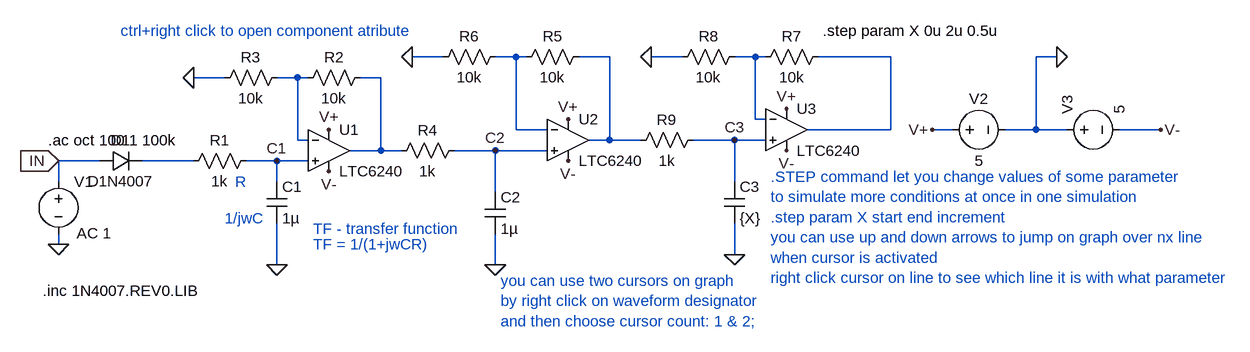
[diagram p0: schematic AC_analysis_with_three_pole_filter.asc]
AC_analysis_with_three_pole_filter.asc, the LTspice schematic file:
Version 4
SHEET 1 1444 680
WIRE -544 -16 -592 -16
WIRE -432 -16 -464 -16
WIRE -416 -16 -432 -16
WIRE -288 -16 -336 -16
WIRE -176 -16 -224 -16
WIRE -64 -16 -96 -16
WIRE -48 -16 -64 -16
WIRE 144 -16 32 -16
WIRE 400 -16 368 -16
WIRE -880 16 -928 16
WIRE -768 16 -800 16
WIRE -752 16 -768 16
WIRE -640 16 -672 16
WIRE -64 80 -64 -16
WIRE -48 80 -64 80
WIRE -432 96 -432 -16
WIRE -384 96 -432 96
WIRE 144 96 144 -16
WIRE 144 96 16 96
WIRE 240 96 208 96
WIRE 368 96 368 -16
WIRE 368 96 320 96
WIRE 416 96 368 96
WIRE 560 96 496 96
WIRE -768 112 -768 16
WIRE -752 112 -768 112
WIRE -288 112 -288 -16
WIRE -288 112 -320 112
WIRE -240 112 -288 112
WIRE -96 112 -160 112
WIRE -48 112 -96 112
WIRE -640 128 -640 16
WIRE -640 128 -688 128
WIRE -608 128 -640 128
WIRE -464 128 -528 128
WIRE -384 128 -464 128
WIRE -1072 144 -1136 144
WIRE -928 144 -1008 144
WIRE -800 144 -848 144
WIRE -752 144 -800 144
WIRE -1136 176 -1136 144
WIRE -800 176 -800 144
WIRE -96 176 -96 112
WIRE -464 192 -464 128
WIRE -1136 272 -1136 256
WIRE -96 288 -96 240
WIRE -800 304 -800 240
WIRE -464 304 -464 256
FLAG -1136 272 0
FLAG -800 304 0
FLAG -1136 144 IN
IOPIN -1136 144 In
FLAG 400 -16 0
FLAG 208 96 V+
FLAG 560 96 V-
FLAG -928 16 0
FLAG -464 304 0
FLAG -352 144 V-
FLAG -720 160 V-
FLAG -720 96 V+
FLAG -352 80 V+
FLAG -16 64 V+
FLAG -16 128 V-
FLAG -592 -16 0
FLAG -224 -16 0
FLAG -96 288 0
FLAG -800 144 C1
FLAG -464 128 C2
FLAG -96 112 C3
SYMBOL voltage -1136 160 R0
WINDOW 123 28 95 Left 2
WINDOW 39 0 0 Left 0
SYMATTR Value2 AC 1
SYMATTR InstName V1
SYMATTR Value ""
SYMBOL res -832 128 R90
WINDOW 0 0 56 VBottom 2
WINDOW 3 32 56 VTop 2
SYMATTR InstName R1
SYMATTR Value 1k
SYMBOL cap -816 176 R0
SYMATTR InstName C1
SYMATTR Value 1µ
SYMBOL OpAmps\\LTC6240 -720 128 R0
SYMATTR InstName U1
SYMBOL voltage 224 96 R270
WINDOW 0 32 56 VTop 2
WINDOW 3 -32 56 VBottom 2
SYMATTR InstName V2
SYMATTR Value 5
SYMBOL voltage 400 96 R270
WINDOW 123 0 0 Left 0
WINDOW 39 0 0 Left 0
SYMATTR InstName V3
SYMATTR Value 5
SYMBOL OpAmps\\LTC6240 -352 112 R0
SYMATTR InstName U2
SYMBOL OpAmps\\LTC6240 -16 96 R0
SYMATTR InstName U3
SYMBOL res -656 0 R90
WINDOW 0 0 56 VBottom 2
WINDOW 3 32 56 VTop 2
SYMATTR InstName R2
SYMATTR Value 10k
SYMBOL res -784 0 R90
WINDOW 0 0 56 VBottom 2
WINDOW 3 32 56 VTop 2
SYMATTR InstName R3
SYMATTR Value 10k
SYMBOL res -512 112 R90
WINDOW 0 0 56 VBottom 2
WINDOW 3 32 56 VTop 2
SYMATTR InstName R4
SYMATTR Value 1k
SYMBOL cap -480 192 R0
SYMATTR InstName C2
SYMATTR Value 1µ
SYMBOL res -320 -32 R90
WINDOW 0 0 56 VBottom 2
WINDOW 3 32 56 VTop 2
SYMATTR InstName R5
SYMATTR Value 10k
SYMBOL res -448 -32 R90
WINDOW 0 0 56 VBottom 2
WINDOW 3 32 56 VTop 2
SYMATTR InstName R6
SYMATTR Value 10k
SYMBOL res 48 -32 R90
WINDOW 0 0 56 VBottom 2
WINDOW 3 32 56 VTop 2
SYMATTR InstName R7
SYMATTR Value 10k
SYMBOL res -80 -32 R90
WINDOW 0 0 56 VBottom 2
WINDOW 3 32 56 VTop 2
SYMATTR InstName R8
SYMATTR Value 10k
SYMBOL cap -112 176 R0
SYMATTR InstName C3
SYMATTR Value {X}
SYMBOL res -144 96 R90
WINDOW 0 0 56 VBottom 2
WINDOW 3 32 56 VTop 2
SYMATTR InstName R9
SYMATTR Value 1k
SYMBOL diode -1072 160 R270
WINDOW 0 32 32 VTop 2
WINDOW 3 0 32 VBottom 2
SYMATTR InstName D1
SYMATTR Value D1N4007
TEXT -1152 112 Left 2 !.ac oct 100 1 100k
TEXT -864 176 Left 2 ;R
TEXT -880 232 Left 2 ;1/jwC
TEXT -744 248 Left 2 ;TF - transfer function
TEXT -744 272 Left 2 ;TF = 1/(1+jwCR)
TEXT -40 168 Left 2 ;.STEP command let you change values of some parameter\nto simulate more conditions at once in one simulation\n.step param X start end increment\nyou can use up and down arrows to jump on graph over nx line\nwhen cursor is activated\nright click cursor on line to see which line it is with what parameter
TEXT 40 -56 Left 2 !.step param X 0u 2u 0.5u
TEXT -1040 -56 Left 2 ;ctrl+right click to open component atribute
TEXT -1160 344 Left 2 !.inc 1N4007.REV0.LIB
TEXT -456 328 Left 2 ;you can use two cursors on graph\nby right click on waveform designator\nand then choose cursor count: 1 & 2;

The netlist it stands for:
* AC_analysis_with_three_pole_filter.asc
V1 IN 0 AC 1
R1 C1 N007 1k
C1 C1 0 1µ
* U1: LTC6240 (symbol OpAmps\LTC6240 not available, pins judged from their places): In+=C1 In-=N005 V+=V+ V-=V- OUT=N006
V2 V+ 0 5
V3 0 V- 5
* U2: LTC6240 (symbol OpAmps\LTC6240 not available, pins judged from their places): In+=C2 In-=N001 V+=V+ V-=V- OUT=N002
* U3: LTC6240 (symbol OpAmps\LTC6240 not available, pins judged from their places): In+=C3 In-=N003 V+=V+ V-=V- OUT=N004
R2 N006 N005 10k
R3 N005 0 10k
R4 C2 N006 1k
C2 C2 0 1µ
R5 N002 N001 10k
R6 N001 0 10k
R7 N004 N003 10k
R8 N003 0 10k
C3 C3 0 {X}
R9 C3 N002 1k
D1 IN N007 D1N4007
.model D D
.lib standard.dio
.ac oct 100 1 100k
* R
* 1/jwC
* TF - transfer function
* TF = 1/(1+jwCR)
* .STEP command let you change values of some parameter
* to simulate more conditions at once in one simulation
* .step param X start end increment
* you can use up and down arrows to jump on graph over nx line
* when cursor is activated
* right click cursor on line to see which line it is with what parameter
.step param X 0u 2u 0.5u
* ctrl+right click to open component atribute
.inc 1N4007.REV0.LIB
* you can use two cursors on graph
* by right click on waveform designator
* and then choose cursor count: 1 & 2;
.backanno
.end